# Altium schematic sheet Main.SchDoc: OpenSCB: MAIN
size A4; Organization: OpenSCB; Revision: 0.2; SheetNumber: 1; SheetTotal: 4
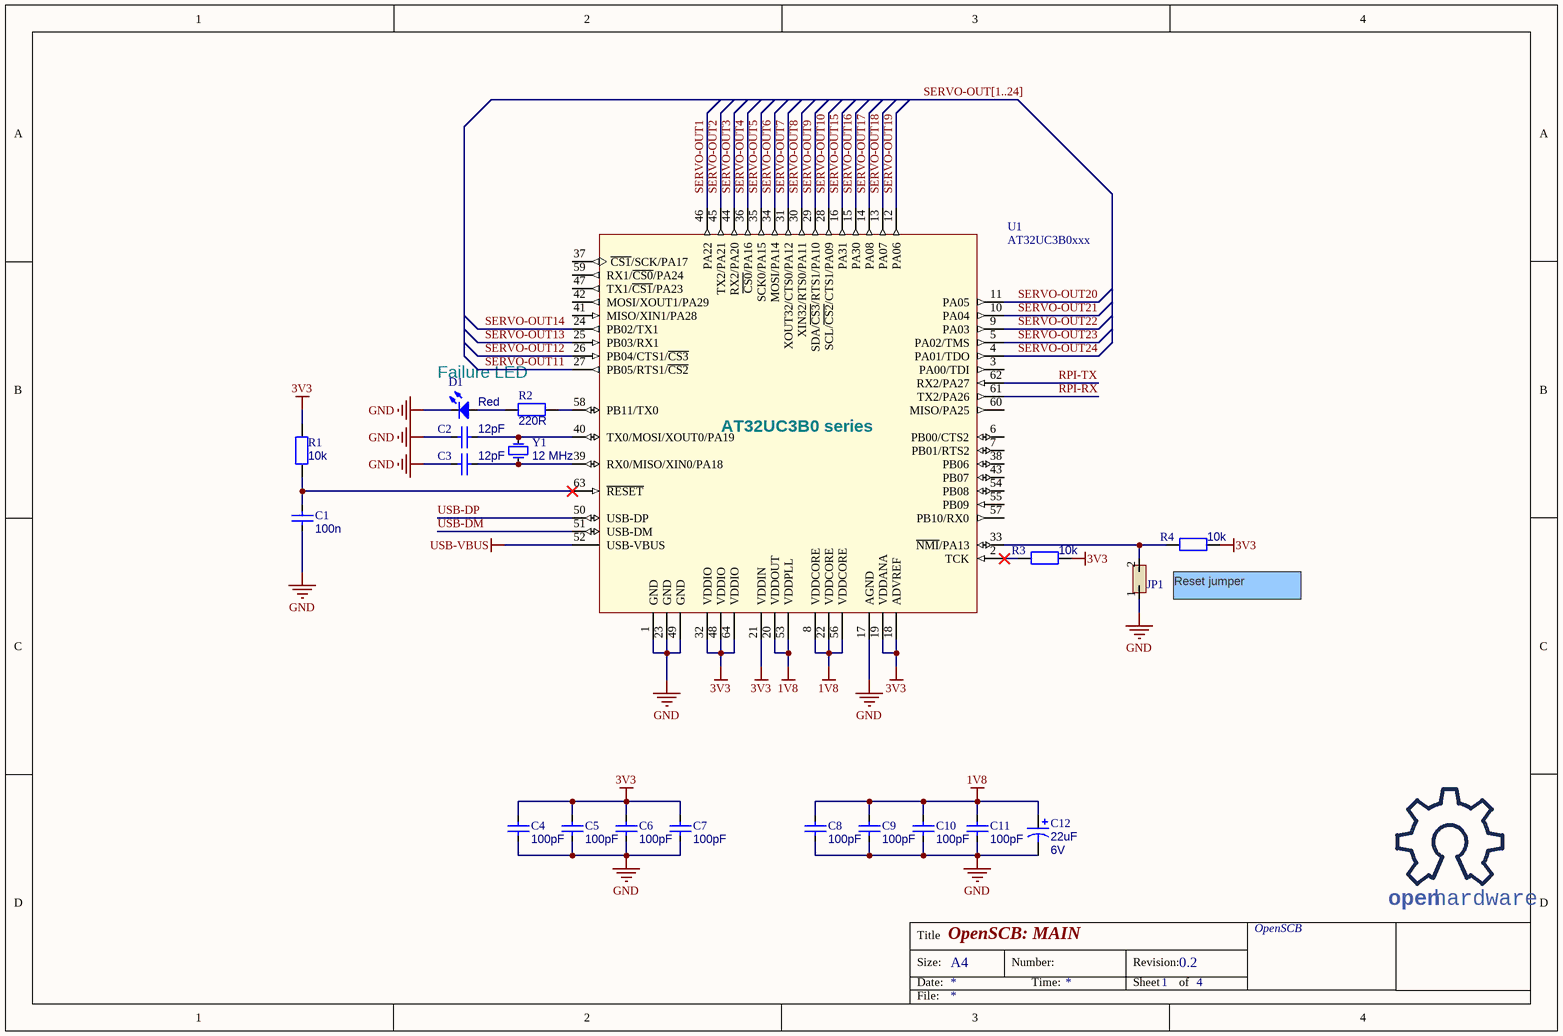
[diagram p0: Main.SchDoc]

## Parts
*1  OSHW  [OSHW]  (value not drawn)
C1  value 100n  [CC1005-0402]  (hidden comment: Condensateur)
C2  value 12pF  [CC1005-0402]  (hidden comment: Condensateur)
C3  value 12pF  [CC1005-0402]  (hidden comment: Condensateur)
C4  value 100pF  [CC1005-0402]  (hidden comment: Condensateur)
C5  value 100pF  [CC1005-0402]  (hidden comment: Condensateur)
C6  value 100pF  [CC1005-0402]  (hidden comment: Condensateur)
C7  value 100pF  [CC1005-0402]  (hidden comment: Condensateur)
C8  value 100pF  [CC1005-0402]  (hidden comment: Condensateur)
C9  value 100pF  [CC1005-0402]  (hidden comment: Condensateur)
C10  value 100pF  [CC1005-0402]  (hidden comment: Condensateur)
C11  value 100pF  [CC1005-0402]  (hidden comment: Condensateur)
C12  value 22uF  Voltage: 6V  [TC3216-1206]  (hidden comment: Condensateur Polarise)
D1  Color: Red  [DIODE-0603]  (hidden comment: Led)
JP1  Jumper  [HDR1X2]  (value not drawn)
R1  value 10k  [CR1005-0402]  (hidden comment: Resistance)
R2  value 220R  [CR1005-0402]  (hidden comment: Resistance)
R3  value 10k  [CR1005-0402]  (hidden comment: Resistance)
R4  value 10k  [CR1005-0402]  (hidden comment: Resistance)
U1  AT32UC3B0xxx  [TSQFP50P1200X1200-64N]
Y1  value 12 MHz  [7B]  (hidden comment: Quartz)

## Nets
1V8: C8.2 C9.2 C10.2 C11.2 C12.1 U1.8(VDDCORE) U1.20(VDDOUT) U1.22(VDDCORE) U1.53(VDDPLL) U1.56(VDDCORE)
3V3: C4.2 C5.2 C6.2 C7.2 R1.2 R3.2 R4.2 U1.18(ADVREF) U1.19(VDDANA) U1.21(VDDIN) U1.32(VDDIO) U1.48(VDDIO) U1.64(VDDIO)
GND: C1.1 C2.1 C3.2 C4.1 C5.1 C6.1 C7.1 C8.1 C9.1 C10.1 C11.1 C12.2 D1.2(K) JP1.1 U1.1(GND) U1.17(AGND) U1.23(GND) U1.49(GND)
USB-VBUS: U1.52(USB-VBUS)
RPI-RX: U1.61(TX2/PA26)
RPI-TX: U1.62(RX2/PA27)
SERVO-OUT1: U1.46(PA22)
SERVO-OUT2: U1.45(TX2/PA21)
SERVO-OUT3: U1.44(RX2/PA20)
SERVO-OUT4: U1.36(~{CS0}/PA16)
SERVO-OUT5: U1.35(SCK0/PA15)
SERVO-OUT6: U1.34(MOSI/PA14)
SERVO-OUT7: U1.31(XOUT32/CTS0/PA12)
SERVO-OUT8: U1.30(XIN32/RTS0/PA11)
SERVO-OUT9: U1.29(SDA/~{CS3}/RTS1/PA10)
SERVO-OUT10: U1.28(SCL/~{CS2}/CTS1/PA09)
SERVO-OUT11: U1.27(PB05/RTS1/~{CS2})
SERVO-OUT12: U1.26(PB04/CTS1/~{CS3})
SERVO-OUT13: U1.25(PB03/RX1)
SERVO-OUT14: U1.24(PB02/TX1)
SERVO-OUT15: U1.16(PA31)
SERVO-OUT16: U1.15(PA30)
SERVO-OUT17: U1.14(PA08)
SERVO-OUT18: U1.13(PA07)
SERVO-OUT19: U1.12(PA06)
SERVO-OUT20: U1.11(PA05)
SERVO-OUT21: U1.10(PA04)
SERVO-OUT22: U1.9(PA03)
SERVO-OUT23: U1.5(PA02/TMS)
SERVO-OUT24: U1.4(PA01/TDO)
USB-DM: U1.51(USB-DM)
USB-DP: U1.50(USB-DP)
NetC1_2: C1.2 R1.1 U1.63(~{RESET})
NetC2_2: C2.2 U1.40(TX0/MOSI/XOUT0/PA19) Y1.2(OSC2)
NetC3_1: C3.1 U1.39(RX0/MISO/XIN0/PA18) Y1.1(OSC1)
NetD1_1: D1.1(A) R2.2
NetJP1_2: JP1.2 R4.1 U1.33(~{NMI}/PA13)
NetR2_1: R2.1 U1.58(PB11/TX0)
NetR3_1: R3.1 U1.2(TCK)

Not connected (* = marked no-connect by the designer): U1 3(PA00/TDI) 6(PB00/CTS2) 7(PB01/RTS2) 37(~{CS1}/SCK/PA17) 38(PB06) 41(MISO/XIN1/PA28) 42(MOSI/XOUT1/PA29) 43(PB07) 47(TX1/~{CS1}/PA23) 54(PB08) 55(PB09) 57(PB10/RX0) 59(RX1/~{CS0}/PA24) 60(MISO/PA25)

## Buses and harness runs
bus SERVO-OUT[1..24]

## Notes on the sheet
- (near D1) Failure LED
- Reset jumper
- Title
- Size:
- Date:
- A4
- Number:
- Time:
- Revision:
- Sheet
- of
- File:
- (in symbol AT32UC3B0xxx) AT32UC3B0 series
- (in symbol OSHW) open; hardware

## Library data of the parts
*1 = OSHW: Open Hardware logo
JP1 = Jumper: Header 2 pts
R1-R4 = Resistance: Precision: 5%; Power: 0.5W
U1 = AT32UC3B0xxx: AVR32 32-Bit Microcontroller
Y1 = Quartz: SMD Crystal oscillator; Precision: 20ppm
C1-C11 = Condensateur: Revision: July-2002: Re-released for DXP Platform.
C12 = Condensateur Polarise: Published: 8-Jun-2000; Revision: July-2002: Re-released for DXP Platform.; Publisher: Altium Limited